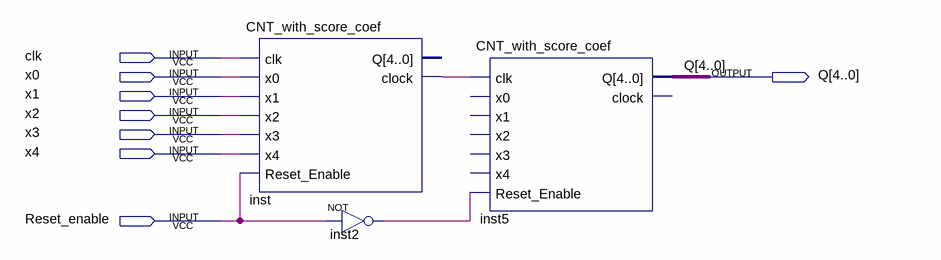
[diagram p0: schematic sheet]
// Quartus schematic CNT_with_prescaller.bdf as structural Verilog: 3 symbols, 8 pins
module CNT_with_prescaller (
  input  clk,
  input  x0,
  input  x1,
  input  x2,
  input  x3,
  input  x4,
  input  Reset_enable,
  output [4:0] Q
);

  wire inst2_out, inst_clock;

  CNT_with_score_coef inst (
    .clk(clk), .x0(x0), .x1(x1), .x2(x2), .x3(x3), .x4(x4), .Reset_Enable(Reset_enable), .clock(inst_clock));  // open: Q
  not inst2 (inst2_out, Reset_enable);
  CNT_with_score_coef inst5 (.clk(inst_clock), .Reset_Enable(inst2_out), .Q(Q));  // open: x0, x1, x2, x3, x4, clock
endmodule
